# Altium schematic sheet Power.SchDoc
size 381 x 241 mm; SheetNumber: 1; SheetTotal: 5
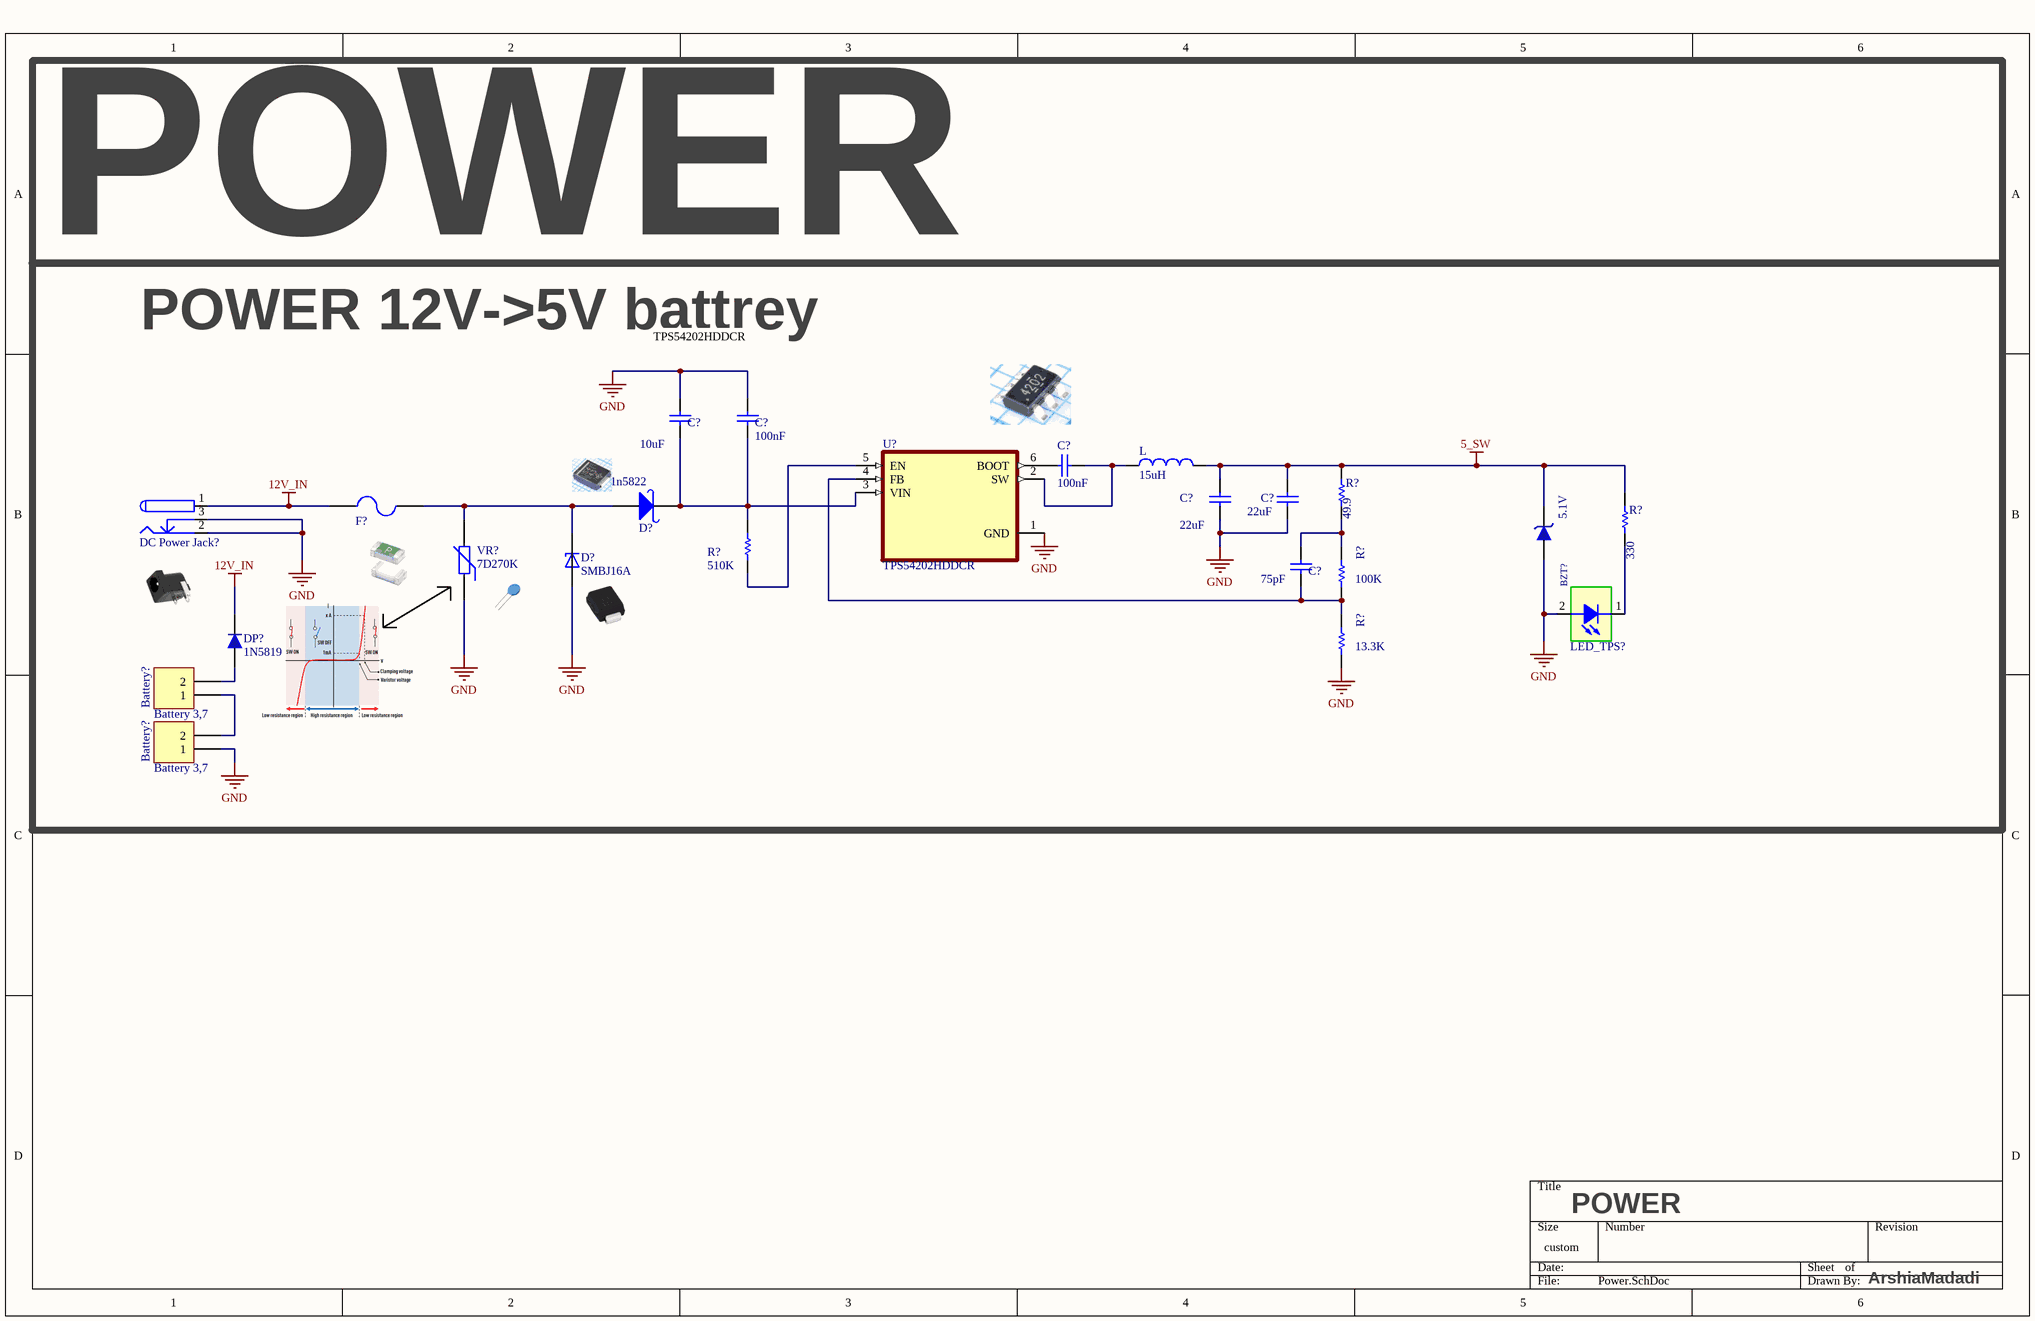
[diagram p0: Power.SchDoc]

## Parts
(Parts that share a designator on the sheet are numbered #1, #2 ... from top to bottom, then left to right.)
Battery?#1  Battery 3,7  [HDR1X2]
Battery?#2  Battery 3,7  [HDR1X2]
BZT?  5.1V  [SOD123]
C?#1  10uF  [MY_CAP_SMD_0603]
C?#2  100nF  [MY_CAP_SMD_0603]
C?#3  100nF  [MY_CAP_SMD_0603]
C?#4  22uF  [MY_CAP_SMD_0603]
C?#5  22uF  [MY_CAP_SMD_0603]
C?#6  75pF  [MY_CAP_SMD_0603]
D?#1  1n5822  [DO-214AB(SMC)]
D?#2  SMBJ16A  [DIOM4336X265N]
DC_Power_Jack?  DC Power Jack  [DC Power Jack 1]  (value not drawn)
DP?  1N5819  [1n58XX DO-201AD]
F?  F=3.0 A  [1206 FUSE]  (value not drawn)
L  15uH  [IND0805]
LED_TPS?  SMD 1206 LED  [LED 1206]  (value not drawn)
R?#1  49.9  [RESC3413X04N]
R?#2  330  [RESC3413X04N]
R?#3  510K  [RESC3413X04N]
R?#4  100K  [RESC3413X04N]
R?#5  13.3K  [RESC3413X04N]
U?  TPS54202HDDCR  [SOT95P280X110-6N]
VR?  7D270K  [07D XXX]

## Nets
5_SW: BZT?.2 C?#4.1 C?#5.1 L.2 R?#1.2 R?#2.2
12V_IN: DC_Power_Jack?.1 DP?.2 F?.1
GND: Battery?#2.1 BZT?.1 C?#1.1 C?#2.1 C?#4.2 C?#5.2 D?#2.A DC_Power_Jack?.2 DC_Power_Jack?.3 LED_TPS?.2 R?#5.2 U?.1(GND) VR?.1
NetBattery?#1_1: Battery?#1.1 Battery?#2.2
NetBattery?#1_2: Battery?#1.2 DP?.1
NetC?#1_2: C?#1.2 C?#2.2 D?#1.2(K) R?#3.1 U?.3(VIN)
NetC?#3_1: C?#3.1 U?.6(BOOT)
NetC?#3_2: C?#3.2 L.1 U?.2(SW)
NetC?#6_1: C?#6.1 R?#1.1 R?#4.1
NetC?#6_2: C?#6.2 R?#4.2 R?#5.1 U?.4(FB)
NetD?#1_1: D?#1.1(A) D?#2.C F?.2 VR?.2
NetLED_TPS?_1: LED_TPS?.1 R?#2.1
NetR?#3_2: R?#3.2 U?.5(EN)

## Notes on the sheet
- POWER
- POWER 12V->5V battrey
- TPS54202HDDCR
- ArshiaMadadi

## Library data of the parts
Battery?#1 Battery?#2 = Header 2: Header, 2-Pin; LatestRevisionDate: 17-Jul-2002; LatestRevisionNote: Re-released for DXP Platform.; Publisher: Altium Limited
BZT? = ZENER GENERAL DIODE: DIODE ZENER GENERAL; VALUE: 12V; Published: 2017-1-12; PackageVersion: 2017-1-12; PackageReference: DO 35; Publisher: Abbas Basereh; PackageDescription: DIODE GEN ZENER; ComponentLink1Description: Manufacturer Link; ComponentLink2Description: Datasheet
C?#1-C?#6 = CAP SMD_0603
D?#1 = 1N5822 SMD: Schottky Rectifiers; Part. No: SS34; Manufacturer: ON Semiconductor/Fairchild; Designer: Abbas Basereh; Link: https://www.aliexpress.com/item/Free-shipping-100pcs-1n5822-sma-smd-do-214ac-Schottky-diode-ss34/32337482329.html?spm=2114.01010208.3.1.zLZDsP&ws_ab_test=searchweb0_0,searchweb201602_4_10065_10068_10084_10083_10080_10082_10081_10060_10061_10062_10056_10055_10054_10059_10099_10078_10079_427_10073_10103_10102_10096_10052_10050_10051,searchweb201603_4&btsid=6e50dc92-ac69-45bc-a19e-209af19ce602; Link: http://www.tme.eu/en/details/ss34/smd-schottky-diodes/vishay/ss34-e357t/; Link: http://www.digikey.com/product-detail/en/on-semiconductor-fairchild/SS34/SS34FSCT-ND/2094459; Data: 16-12-2016
D?#2 = SMBJ16A: 600W, 18.8V, 5%, Unidirectional, TVS; MF: Taiwan Semiconductor; MP: SMBJ16A; SnapEDA_Link: https://www.snapeda.com/parts/SMBJ16A/Taiwan+Semiconductor/view-part/?ref=snap; Check_prices: https://www.snapeda.com/parts/SMBJ16A/Taiwan+Semiconductor/view-part/?ref=eda; Price: None; Availability: In Stock; Purchase-URL: https://pricing.snapeda.com/search/part/SMBJ16A/?ref=eda; Package: SMD-2-2 Avago; Value: *
DC_Power_Jack? = DC Power Jack: DC Power Jack. Center Pin 2.5mm. Diameter: 5.7mm; Designer: Ali Hafizi; Company: Personal; Project Name: Laser; Adding Date: 10/21/2009
DP? = 1N5819: Schottkey Rectifiers; Designer: Abbas Basereh; Data: 16-12-2016; Link: *; Part. No: *
F? = Fuse SMD1206: SMD Fuses 1206; Designer: Abbas Basereh; Desc.: SMD Fuses 1206; Data: 16-12-2016
L = INDUCTOR SMD PACKAGE: TOTAL INDUCTOR SMD PACK; Designer: Abbas Basereh; Desc.: INDUCTOR  SMD TOTAL PACKAGES; VALUE: 1u; Data: 2017-3-10
LED_TPS? = LED SMD 1206
R?#1-R?#5 = RES 0805 0.125W: RES 0805; Designer: Abbas Basereh; Desc.: RES SMD 0805; Data: 16-12-2016
U? = TPS54202HDDCR: 4.5V to 28V Input, 2A Output, Synchronous Step-Down Voltage Converter 6-SOT-23-THIN -40 to 125; MF: Texas Instruments; MP: TPS54202HDDCR; Price: None; Availability: Good; Check_prices: https://www.snapeda.com/parts/TPS54202HDDCR/Texas%20Instruments/view-part/573706/?ref=eda; Package: SOT-23-THN-6 Texas Instruments; Purchase-URL: https://pricing.snapeda.com/search/part/TPS54202HDDCR/?ref=eda; SnapEDA_Link: https://www.snapeda.com/parts/TPS54202HDDCR/Texas%20Instruments/view-part/573706/?ref=snap; Value: *
VR? = VARISTOR (VDR): VARISTORS; Manufacturer: china-canada-philipina; Designer: Abbas Basereh; VALUE: xxDxxx; Models: MOV-VDR-COV; Data: 2017-1-5; Link: digikey.com; PUBLISHER: ABBAS BASEREH